# Altium schematic sheet Processor.SchDoc
size A2; Date: Date; CompanyName: HESSO; Engineer: Name; Address1: Route du Rawyl 47; Address2: 1950 Sion; Address3: Switzerland; DocumentNumber: 1; SheetNumber: 1; SheetTotal: 8; ProjectName: Project Name
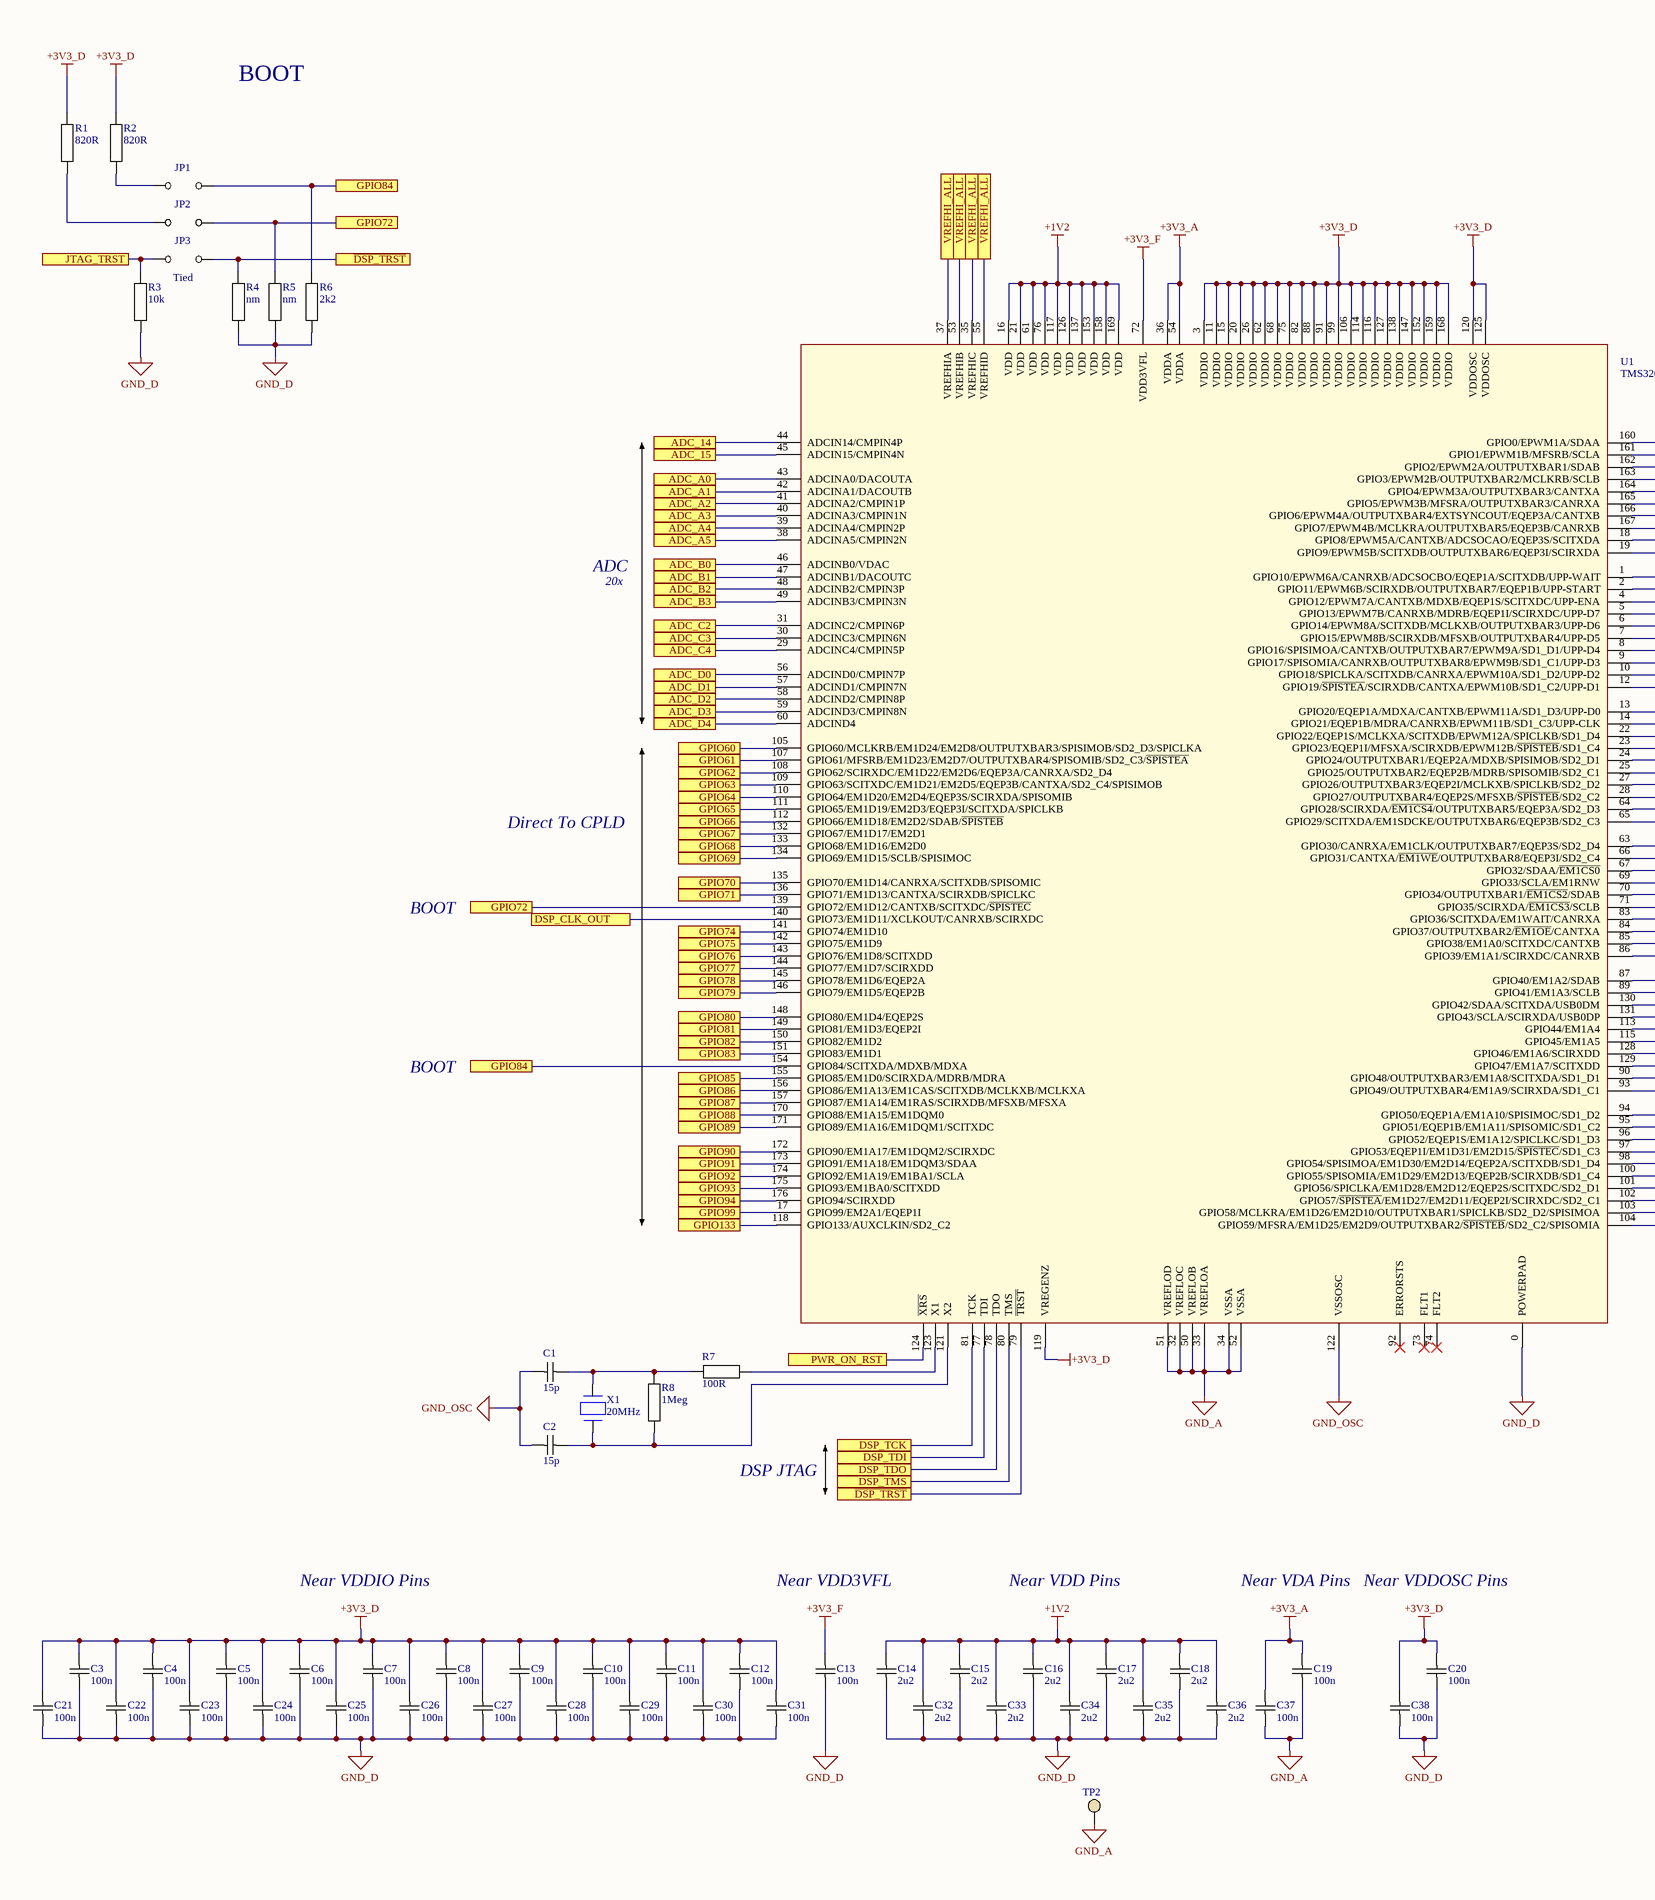
[diagram p0: Processor.SchDoc, left]
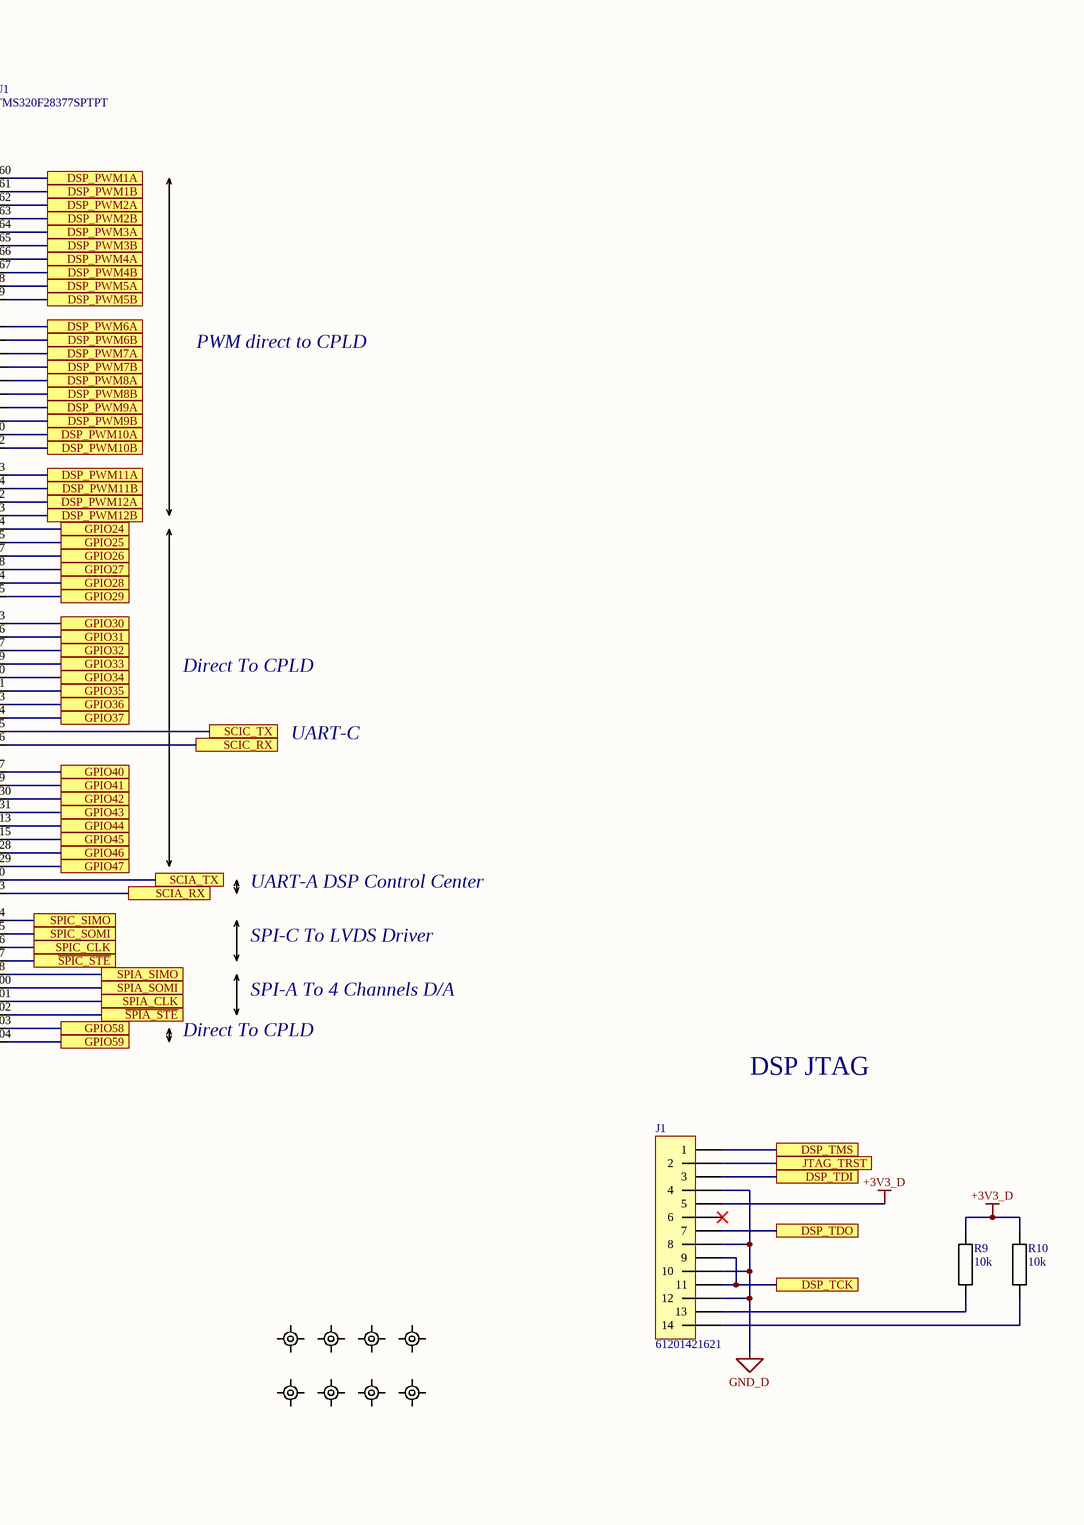
[diagram p1: Processor.SchDoc, right]

## Parts
C1  15p  [CAPACITOR 1608 REFLOW]
C2  15p  [CAPACITOR 1608 REFLOW]
C3  100n  [CAPACITOR 1608 REFLOW]
C4  100n  [CAPACITOR 1608 REFLOW]
C5  100n  [CAPACITOR 1608 REFLOW]
C6  100n  [CAPACITOR 1608 REFLOW]
C7  100n  [CAPACITOR 1608 REFLOW]
C8  100n  [CAPACITOR 1608 REFLOW]
C9  100n  [CAPACITOR 1608 REFLOW]
C10  100n  [CAPACITOR 1608 REFLOW]
C11  100n  [CAPACITOR 1608 REFLOW]
C12  100n  [CAPACITOR 1608 REFLOW]
C13  100n  [CAPACITOR 1608 REFLOW]
C14  2u2  [CAPACITOR 1608 REFLOW]
C15  2u2  [CAPACITOR 1608 REFLOW]
C16  2u2  [CAPACITOR 1608 REFLOW]
C17  2u2  [CAPACITOR 1608 REFLOW]
C18  2u2  [CAPACITOR 1608 REFLOW]
C19  100n  [CAPACITOR 1608 REFLOW]
C20  100n  [CAPACITOR 1608 REFLOW]
C21  100n  [CAPACITOR 1608 REFLOW]
C22  100n  [CAPACITOR 1608 REFLOW]
C23  100n  [CAPACITOR 1608 REFLOW]
C24  100n  [CAPACITOR 1608 REFLOW]
C25  100n  [CAPACITOR 1608 REFLOW]
C26  100n  [CAPACITOR 1608 REFLOW]
C27  100n  [CAPACITOR 1608 REFLOW]
C28  100n  [CAPACITOR 1608 REFLOW]
C29  100n  [CAPACITOR 1608 REFLOW]
C30  100n  [CAPACITOR 1608 REFLOW]
C31  100n  [CAPACITOR 1608 REFLOW]
C32  2u2  [CAPACITOR 1608 REFLOW]
C33  2u2  [CAPACITOR 1608 REFLOW]
C34  2u2  [CAPACITOR 1608 REFLOW]
C35  2u2  [CAPACITOR 1608 REFLOW]
C36  2u2  [CAPACITOR 1608 REFLOW]
C37  100n  [CAPACITOR 1608 REFLOW]
C38  100n  [CAPACITOR 1608 REFLOW]
J1  61201421621  [FlatCable2x7 2.54MM Straight TH]
JP1  Tied  [JUMPER2 SMD 1608]  (value not drawn)  (net tie, no BOM)
JP2  Tied  [JUMPER2 SMD 1608]  (value not drawn)  (net tie, no BOM)
JP3  Tied  [JUMPER2 SMD 1608]  (net tie, no BOM)
R1  820R  [RESISTOR 1608 REFLOW]
R2  820R  [RESISTOR 1608 REFLOW]
R3  10k  [RESISTOR 1608 REFLOW]
R4  nm  [RESISTOR 1608 REFLOW]
R5  nm  [RESISTOR 1608 REFLOW]
R6  2k2  [RESISTOR 1608 REFLOW]
R7  100R  [RESISTOR 1608 REFLOW]
R8  1Meg  [RESISTOR 1608 REFLOW]
R9  10k  [RESISTOR 1608 REFLOW]
R10  10k  [RESISTOR 1608 REFLOW]
TP2  *  [Test Point Keystone Miniature BLACK]  (value not drawn)
U1  TMS320F28377SPTPT  [PQFP176 P0.5 C24.2X24.2 H1.5]
X1  20MHz  [Quartz HC49/4H SMX]
Z1  1 - 3  [FIDUCIAL]  (value not drawn)
Z2  1 - 3  [FIDUCIAL]  (value not drawn)
Z3  1 - 3  [FIDUCIAL]  (value not drawn)
Z4  1 - 3  [FIDUCIAL]  (value not drawn)
Z5  1 - 3  [FIDUCIAL]  (value not drawn)
Z6  1 - 3  [FIDUCIAL]  (value not drawn)
Z7  1 - 3  [FIDUCIAL]  (value not drawn)
Z8  1 - 3  [FIDUCIAL]  (value not drawn)

## Ports
ADC_14, ADC_15, ADC_A0, ADC_A1, ADC_A2, ADC_A3, ADC_A4, ADC_A5, ADC_B0, ADC_B1, ADC_B2, ADC_B3, ADC_C2, ADC_C3, ADC_C4, ADC_D0, ADC_D1, ADC_D2, ADC_D3, ADC_D4, DSP_CLK_OUT, DSP_PWM1A, DSP_PWM1B, DSP_PWM2A, DSP_PWM2B, DSP_PWM3A, DSP_PWM3B, DSP_PWM4A, DSP_PWM4B, DSP_PWM5A, DSP_PWM5B, DSP_PWM6A, DSP_PWM6B, DSP_PWM7A, DSP_PWM7B, DSP_PWM8A, DSP_PWM8B, DSP_PWM9A, DSP_PWM9B, DSP_PWM10A, DSP_PWM10B, DSP_PWM11A, DSP_PWM11B, DSP_PWM12A, DSP_PWM12B, DSP_TCK, DSP_TDI, DSP_TDO, DSP_TMS, GPIO24, GPIO25, GPIO26, GPIO27, GPIO28, GPIO29, GPIO30, GPIO31, GPIO32, GPIO33, GPIO34, GPIO35, GPIO36, GPIO37, GPIO40, GPIO41, GPIO42, GPIO43, GPIO44, GPIO45, GPIO46, GPIO47, GPIO58, GPIO59, GPIO60, GPIO61, GPIO62, GPIO63, GPIO64, GPIO65, GPIO66, GPIO67, GPIO68, GPIO69, GPIO70, GPIO71, GPIO72, GPIO74, GPIO75, GPIO76, GPIO77, GPIO78, GPIO79, GPIO80, GPIO81, GPIO82, GPIO83, GPIO84, GPIO85, GPIO86, GPIO87, GPIO88, GPIO89, GPIO90, GPIO91, GPIO92, GPIO93, GPIO94, GPIO99, GPIO133, JTAG_TRST, PWR_ON_RST, SCIA_RX, SCIA_TX, SCIC_RX, SCIC_TX, SPIA_CLK, SPIA_SIMO, SPIA_SOMI, SPIC_CLK, SPIC_SIMO, SPIC_SOMI, VREFHI_ALL, ~{DSP_TRST}, ~{SPIA_STE}, ~{SPIC_STE}

## Nets
+1V2: C14.2 C15.2 C16.2 C17.2 C18.2 C32.2 C33.2 C34.2 C35.2 C36.2 U1.16(VDD) U1.21(VDD) U1.61(VDD) U1.76(VDD) U1.117(VDD) U1.126(VDD) U1.137(VDD) U1.153(VDD) U1.158(VDD) U1.169(VDD)
+3V3_A: C19.2 C37.2 U1.36(VDDA) U1.54(VDDA)
+3V3_D: C3.2 C4.2 C5.2 C6.2 C7.2 C8.2 C9.2 C10.2 C11.2 C12.2 C20.2 C21.2 C22.2 C23.2 C24.2 C25.2 C26.2 C27.2 C28.2 C29.2 C30.2 C31.2 C38.2 J1.5 R1.2 R2.2 R9.2 R10.2 U1.3(VDDIO) U1.11(VDDIO) U1.15(VDDIO) U1.20(VDDIO) U1.26(VDDIO) U1.62(VDDIO) U1.68(VDDIO) U1.75(VDDIO) U1.82(VDDIO) U1.88(VDDIO) U1.91(VDDIO) U1.99(VDDIO) U1.106(VDDIO) U1.114(VDDIO) U1.116(VDDIO) U1.119(VREGENZ) U1.120(VDDOSC) U1.125(VDDOSC) U1.127(VDDIO) U1.138(VDDIO) U1.147(VDDIO) U1.152(VDDIO) U1.159(VDDIO) U1.168(VDDIO)
+3V3_F: C13.2 U1.72(VDD3VFL)
GND_A: C19.1 C37.1 TP2.1 U1.32(VREFLOC) U1.33(VREFLOA) U1.34(VSSA) U1.50(VREFLOB) U1.51(VREFLOD) U1.52(VSSA)
GND_D: C3.1 C4.1 C5.1 C6.1 C7.1 C8.1 C9.1 C10.1 C11.1 C12.1 C13.1 C14.1 C15.1 C16.1 C17.1 C18.1 C20.1 C21.1 C22.1 C23.1 C24.1 C25.1 C26.1 C27.1 C28.1 C29.1 C30.1 C31.1 C32.1 C33.1 C34.1 C35.1 C36.1 C38.1 J1.4 J1.8 J1.10 J1.12 R3.1 R4.1 R5.1 R6.1 U1.0(POWERPAD)
GND_OSC: C1.1 C2.1 U1.122(VSSOSC)
~{SPIA_STE}: U1.102(GPIO57/~{SPISTEA}/EM1D27/EM2D11/EQEP2I/SCIRXDC/SD2_C1) ; port ~{SPIA_STE}
~{SPIC_STE}: U1.97(GPIO53/EQEP1I/EM1D31/EM2D15/~{SPISTEC}/SD1_C3) ; port ~{SPIC_STE}
ADC_14: U1.44(ADCIN14/CMPIN4P) ; port ADC_14
ADC_15: U1.45(ADCIN15/CMPIN4N) ; port ADC_15
ADC_A0: U1.43(ADCINA0/DACOUTA) ; port ADC_A0
ADC_A1: U1.42(ADCINA1/DACOUTB) ; port ADC_A1
ADC_A2: U1.41(ADCINA2/CMPIN1P) ; port ADC_A2
ADC_A3: U1.40(ADCINA3/CMPIN1N) ; port ADC_A3
ADC_A4: U1.39(ADCINA4/CMPIN2P) ; port ADC_A4
ADC_A5: U1.38(ADCINA5/CMPIN2N) ; port ADC_A5
ADC_B0: U1.46(ADCINB0/VDAC) ; port ADC_B0
ADC_B1: U1.47(ADCINB1/DACOUTC) ; port ADC_B1
ADC_B2: U1.48(ADCINB2/CMPIN3P) ; port ADC_B2
ADC_B3: U1.49(ADCINB3/CMPIN3N) ; port ADC_B3
ADC_C2: U1.31(ADCINC2/CMPIN6P) ; port ADC_C2
ADC_C3: U1.30(ADCINC3/CMPIN6N) ; port ADC_C3
ADC_C4: U1.29(ADCINC4/CMPIN5P) ; port ADC_C4
ADC_D0: U1.56(ADCIND0/CMPIN7P) ; port ADC_D0
ADC_D1: U1.57(ADCIND1/CMPIN7N) ; port ADC_D1
ADC_D2: U1.58(ADCIND2/CMPIN8P) ; port ADC_D2
ADC_D3: U1.59(ADCIND3/CMPIN8N) ; port ADC_D3
ADC_D4: U1.60(ADCIND4) ; port ADC_D4
~{DSP_TRST}: JP3.2 R4.2 U1.79(~{TRST}) ; port ~{DSP_TRST}
DSP_CLK_OUT: U1.140(GPIO73/EM1D11/XCLKOUT/CANRXB/SCIRXDC) ; port DSP_CLK_OUT
DSP_PWM1A: U1.160(GPIO0/EPWM1A/SDAA) ; port DSP_PWM1A
DSP_PWM1B: U1.161(GPIO1/EPWM1B/MFSRB/SCLA) ; port DSP_PWM1B
DSP_PWM2A: U1.162(GPIO2/EPWM2A/OUTPUTXBAR1/SDAB) ; port DSP_PWM2A
DSP_PWM2B: U1.163(GPIO3/EPWM2B/OUTPUTXBAR2/MCLKRB/SCLB) ; port DSP_PWM2B
DSP_PWM3A: U1.164(GPIO4/EPWM3A/OUTPUTXBAR3/CANTXA) ; port DSP_PWM3A
DSP_PWM3B: U1.165(GPIO5/EPWM3B/MFSRA/OUTPUTXBAR3/CANRXA) ; port DSP_PWM3B
DSP_PWM4A: U1.166(GPIO6/EPWM4A/OUTPUTXBAR4/EXTSYNCOUT/EQEP3A/CANTXB) ; port DSP_PWM4A
DSP_PWM4B: U1.167(GPIO7/EPWM4B/MCLKRA/OUTPUTXBAR5/EQEP3B/CANRXB) ; port DSP_PWM4B
DSP_PWM5A: U1.18(GPIO8/EPWM5A/CANTXB/ADCSOCAO/EQEP3S/SCITXDA) ; port DSP_PWM5A
DSP_PWM5B: U1.19(GPIO9/EPWM5B/SCITXDB/OUTPUTXBAR6/EQEP3I/SCIRXDA) ; port DSP_PWM5B
DSP_PWM6A: U1.1(GPIO10/EPWM6A/CANRXB/ADCSOCBO/EQEP1A/SCITXDB/UPP-WAIT) ; port DSP_PWM6A
DSP_PWM6B: U1.2(GPIO11/EPWM6B/SCIRXDB/OUTPUTXBAR7/EQEP1B/UPP-START) ; port DSP_PWM6B
DSP_PWM7A: U1.4(GPIO12/EPWM7A/CANTXB/MDXB/EQEP1S/SCITXDC/UPP-ENA) ; port DSP_PWM7A
DSP_PWM7B: U1.5(GPIO13/EPWM7B/CANRXB/MDRB/EQEP1I/SCIRXDC/UPP-D7) ; port DSP_PWM7B
DSP_PWM8A: U1.6(GPIO14/EPWM8A/SCITXDB/MCLKXB/OUTPUTXBAR3/UPP-D6) ; port DSP_PWM8A
DSP_PWM8B: U1.7(GPIO15/EPWM8B/SCIRXDB/MFSXB/OUTPUTXBAR4/UPP-D5) ; port DSP_PWM8B
DSP_PWM9A: U1.8(GPIO16/SPISIMOA/CANTXB/OUTPUTXBAR7/EPWM9A/SD1_D1/UPP-D4) ; port DSP_PWM9A
DSP_PWM9B: U1.9(GPIO17/SPISOMIA/CANRXB/OUTPUTXBAR8/EPWM9B/SD1_C1/UPP-D3) ; port DSP_PWM9B
DSP_PWM10A: U1.10(GPIO18/SPICLKA/SCITXDB/CANRXA/EPWM10A/SD1_D2/UPP-D2) ; port DSP_PWM10A
DSP_PWM10B: U1.12(GPIO19/~{SPISTEA}/SCIRXDB/CANTXA/EPWM10B/SD1_C2/UPP-D1) ; port DSP_PWM10B
DSP_PWM11A: U1.13(GPIO20/EQEP1A/MDXA/CANTXB/EPWM11A/SD1_D3/UPP-D0) ; port DSP_PWM11A
DSP_PWM11B: U1.14(GPIO21/EQEP1B/MDRA/CANRXB/EPWM11B/SD1_C3/UPP-CLK) ; port DSP_PWM11B
DSP_PWM12A: U1.22(GPIO22/EQEP1S/MCLKXA/SCITXDB/EPWM12A/SPICLKB/SD1_D4) ; port DSP_PWM12A
DSP_PWM12B: U1.23(GPIO23/EQEP1I/MFSXA/SCIRXDB/EPWM12B/~{SPISTEB}/SD1_C4) ; port DSP_PWM12B
DSP_TCK: J1.9 J1.11 U1.81(TCK) ; port DSP_TCK
DSP_TDI: J1.3 U1.77(TDI) ; port DSP_TDI
DSP_TDO: J1.7 U1.78(TDO) ; port DSP_TDO
DSP_TMS: J1.1 U1.80(TMS) ; port DSP_TMS
GPIO24: U1.24(GPIO24/OUTPUTXBAR1/EQEP2A/MDXB/SPISIMOB/SD2_D1) ; port GPIO24
GPIO25: U1.25(GPIO25/OUTPUTXBAR2/EQEP2B/MDRB/SPISOMIB/SD2_C1) ; port GPIO25
GPIO26: U1.27(GPIO26/OUTPUTXBAR3/EQEP2I/MCLKXB/SPICLKB/SD2_D2) ; port GPIO26
GPIO27: U1.28(GPIO27/OUTPUTXBAR4/EQEP2S/MFSXB/~{SPISTEB}/SD2_C2) ; port GPIO27
GPIO28: U1.64(GPIO28/SCIRXDA/~{EM1CS4}/OUTPUTXBAR5/EQEP3A/SD2_D3) ; port GPIO28
GPIO29: U1.65(GPIO29/SCITXDA/EM1SDCKE/OUTPUTXBAR6/EQEP3B/SD2_C3) ; port GPIO29
GPIO30: U1.63(GPIO30/CANRXA/EM1CLK/OUTPUTXBAR7/EQEP3S/SD2_D4) ; port GPIO30
GPIO31: U1.66(GPIO31/CANTXA/~{EM1WE}/OUTPUTXBAR8/EQEP3I/SD2_C4) ; port GPIO31
GPIO32: U1.67(GPIO32/SDAA/~{EM1CS0}) ; port GPIO32
GPIO33: U1.69(GPIO33/SCLA/EM1RNW) ; port GPIO33
GPIO34: U1.70(GPIO34/OUTPUTXBAR1/~{EM1CS2}/SDAB) ; port GPIO34
GPIO35: U1.71(GPIO35/SCIRXDA/~{EM1CS3}/SCLB) ; port GPIO35
GPIO36: U1.83(GPIO36/SCITXDA/EM1WAIT/CANRXA) ; port GPIO36
GPIO37: U1.84(GPIO37/OUTPUTXBAR2/~{EM1OE}/CANTXA) ; port GPIO37
GPIO40: U1.87(GPIO40/EM1A2/SDAB) ; port GPIO40
GPIO41: U1.89(GPIO41/EM1A3/SCLB) ; port GPIO41
GPIO42: U1.130(GPIO42/SDAA/SCITXDA/USB0DM) ; port GPIO42
GPIO43: U1.131(GPIO43/SCLA/SCIRXDA/USB0DP) ; port GPIO43
GPIO44: U1.113(GPIO44/EM1A4) ; port GPIO44
GPIO45: U1.115(GPIO45/EM1A5) ; port GPIO45
GPIO46: U1.128(GPIO46/EM1A6/SCIRXDD) ; port GPIO46
GPIO47: U1.129(GPIO47/EM1A7/SCITXDD) ; port GPIO47
GPIO58: U1.103(GPIO58/MCLKRA/EM1D26/EM2D10/OUTPUTXBAR1/SPICLKB/SD2_D2/SPISIMOA) ; port GPIO58
GPIO59: U1.104(GPIO59/MFSRA/EM1D25/EM2D9/OUTPUTXBAR2/~{SPISTEB}/SD2_C2/SPISOMIA) ; port GPIO59
GPIO60: U1.105(GPIO60/MCLKRB/EM1D24/EM2D8/OUTPUTXBAR3/SPISIMOB/SD2_D3/SPICLKA) ; port GPIO60
GPIO61: U1.107(GPIO61/MFSRB/EM1D23/EM2D7/OUTPUTXBAR4/SPISOMIB/SD2_C3/~{SPISTEA}) ; port GPIO61
GPIO62: U1.108(GPIO62/SCIRXDC/EM1D22/EM2D6/EQEP3A/CANRXA/SD2_D4) ; port GPIO62
GPIO63: U1.109(GPIO63/SCITXDC/EM1D21/EM2D5/EQEP3B/CANTXA/SD2_C4/SPISIMOB) ; port GPIO63
GPIO64: U1.110(GPIO64/EM1D20/EM2D4/EQEP3S/SCIRXDA/SPISOMIB) ; port GPIO64
GPIO65: U1.111(GPIO65/EM1D19/EM2D3/EQEP3I/SCITXDA/SPICLKB) ; port GPIO65
GPIO66: U1.112(GPIO66/EM1D18/EM2D2/SDAB/~{SPISTEB}) ; port GPIO66
GPIO67: U1.132(GPIO67/EM1D17/EM2D1) ; port GPIO67
GPIO68: U1.133(GPIO68/EM1D16/EM2D0) ; port GPIO68
GPIO69: U1.134(GPIO69/EM1D15/SCLB/SPISIMOC) ; port GPIO69
GPIO70: U1.135(GPIO70/EM1D14/CANRXA/SCITXDB/SPISOMIC) ; port GPIO70
GPIO71: U1.136(GPIO71/EM1D13/CANTXA/SCIRXDB/SPICLKC) ; port GPIO71
GPIO72: JP2.2 R5.2 U1.139(GPIO72/EM1D12/CANTXB/SCITXDC/~{SPISTEC}) ; port GPIO72
GPIO74: U1.141(GPIO74/EM1D10) ; port GPIO74
GPIO75: U1.142(GPIO75/EM1D9) ; port GPIO75
GPIO76: U1.143(GPIO76/EM1D8/SCITXDD) ; port GPIO76
GPIO77: U1.144(GPIO77/EM1D7/SCIRXDD) ; port GPIO77
GPIO78: U1.145(GPIO78/EM1D6/EQEP2A) ; port GPIO78
GPIO79: U1.146(GPIO79/EM1D5/EQEP2B) ; port GPIO79
GPIO80: U1.148(GPIO80/EM1D4/EQEP2S) ; port GPIO80
GPIO81: U1.149(GPIO81/EM1D3/EQEP2I) ; port GPIO81
GPIO82: U1.150(GPIO82/EM1D2) ; port GPIO82
GPIO83: U1.151(GPIO83/EM1D1) ; port GPIO83
GPIO84: JP1.2 R6.2 U1.154(GPIO84/SCITXDA/MDXB/MDXA) ; port GPIO84
GPIO85: U1.155(GPIO85/EM1D0/SCIRXDA/MDRB/MDRA) ; port GPIO85
GPIO86: U1.156(GPIO86/EM1A13/EM1CAS/SCITXDB/MCLKXB/MCLKXA) ; port GPIO86
GPIO87: U1.157(GPIO87/EM1A14/EM1RAS/SCIRXDB/MFSXB/MFSXA) ; port GPIO87
GPIO88: U1.170(GPIO88/EM1A15/EM1DQM0) ; port GPIO88
GPIO89: U1.171(GPIO89/EM1A16/EM1DQM1/SCITXDC) ; port GPIO89
GPIO90: U1.172(GPIO90/EM1A17/EM1DQM2/SCIRXDC) ; port GPIO90
GPIO91: U1.173(GPIO91/EM1A18/EM1DQM3/SDAA) ; port GPIO91
GPIO92: U1.174(GPIO92/EM1A19/EM1BA1/SCLA) ; port GPIO92
GPIO93: U1.175(GPIO93/EM1BA0/SCITXDD) ; port GPIO93
GPIO94: U1.176(GPIO94/SCIRXDD) ; port GPIO94
GPIO99: U1.17(GPIO99/EM2A1/EQEP1I) ; port GPIO99
GPIO133: U1.118(GPIO133/AUXCLKIN/SD2_C2) ; port GPIO133
JTAG_TRST: J1.2 JP3.1 R3.2 ; port JTAG_TRST
PWR_ON_RST: U1.124(~{XRS}) ; port PWR_ON_RST
SCIA_RX: U1.93(GPIO49/OUTPUTXBAR4/EM1A9/SCIRXDA/SD1_C1) ; port SCIA_RX
SCIA_TX: U1.90(GPIO48/OUTPUTXBAR3/EM1A8/SCITXDA/SD1_D1) ; port SCIA_TX
SCIC_RX: U1.86(GPIO39/EM1A1/SCIRXDC/CANRXB) ; port SCIC_RX
SCIC_TX: U1.85(GPIO38/EM1A0/SCITXDC/CANTXB) ; port SCIC_TX
SPIA_CLK: U1.101(GPIO56/SPICLKA/EM1D28/EM2D12/EQEP2S/SCITXDC/SD2_D1) ; port SPIA_CLK
SPIA_SIMO: U1.98(GPIO54/SPISIMOA/EM1D30/EM2D14/EQEP2A/SCITXDB/SD1_D4) ; port SPIA_SIMO
SPIA_SOMI: U1.100(GPIO55/SPISOMIA/EM1D29/EM2D13/EQEP2B/SCIRXDB/SD1_C4) ; port SPIA_SOMI
SPIC_CLK: U1.96(GPIO52/EQEP1S/EM1A12/SPICLKC/SD1_D3) ; port SPIC_CLK
SPIC_SIMO: U1.94(GPIO50/EQEP1A/EM1A10/SPISIMOC/SD1_D2) ; port SPIC_SIMO
SPIC_SOMI: U1.95(GPIO51/EQEP1B/EM1A11/SPISOMIC/SD1_C2) ; port SPIC_SOMI
VREFHI_ALL: U1.35(VREFHIC) U1.37(VREFHIA) U1.53(VREFHIB) U1.55(VREFHID) ; port VREFHI_ALL
NetC1_2: C1.2 R7.1 R8.2 X1.2
NetC2_2: C2.2 R8.1 U1.121(X2) X1.1
NetJ1_13: J1.13 R9.1
NetJ1_14: J1.14 R10.1
NetJP1_1: JP1.1 R2.1
NetJP2_1: JP2.1 R1.1
NetR7_2: R7.2 U1.123(X1)

Not connected (* = marked no-connect by the designer): J1 6*; U1 73(FLT1)* 74(FLT2)* 92(ERRORSTS)*

## Notes on the sheet
- BOOT
- ADC
- 20x
- PWM direct to CPLD
- Direct To CPLD
- UART-C
- SPI-C To LVDS Driver
- UART-A DSP Control Center
- SPI-A To 4 Channels D/A
- DSP JTAG
- Near VDDIO Pins
- Near VDD3VFL
- Near VDD Pins
- Near VDA Pins
- Near VDDOSC Pins
- Date :
- Revision :
- Sheet
- of
- Design by :

## Library data of the parts
C1-C13 C19-C31 C37 C38 = Capacitor: Capacitor X7R 10% 50V 1608(0603)
  C1 C2: Value: 15p
  C3-C13 C19-C31 C37 C38: Value: 100n
C14-C18 C32-C36 = Capacitor: Capacitor X7R 10% 10V 1608(0603); Value: 2u2
J1 = FlatCable2x7: Manufacturer: Wurth Elektronik; Mouser No.: 710-61201421621; Value: 61201421621
JP1-JP3 = JUMPER 2 POS: Value: Tied
R1-R10 = Resistor: Resistor 1% 50V 100mW 1608(0603)
  R1 R2: Value: 820R
  R3 R9 R10: Value: 10k
  R4 R5: Value: nm
  R6: Value: 2k2
  R7: Value: 100R
  R8: Value: 1Meg
TP2 = Test Point: Value: *
U1 = TMS320F28377S-176P: Manufacturer: Texas Instruments; Value: TMS320F28377SPTPT; Mouser No.: 595-MS320F28377SPTPT
X1 = Quartz HC49/4H SMX
Z1-Z8 = FIDUCIAL: FIDUCIAL Din 1mm Dout 3mm; Value: 1 - 3